# Altium schematic sheet Power Management.SchDoc
size 381 x 241 mm; SheetNumber: 3; SheetTotal: 4
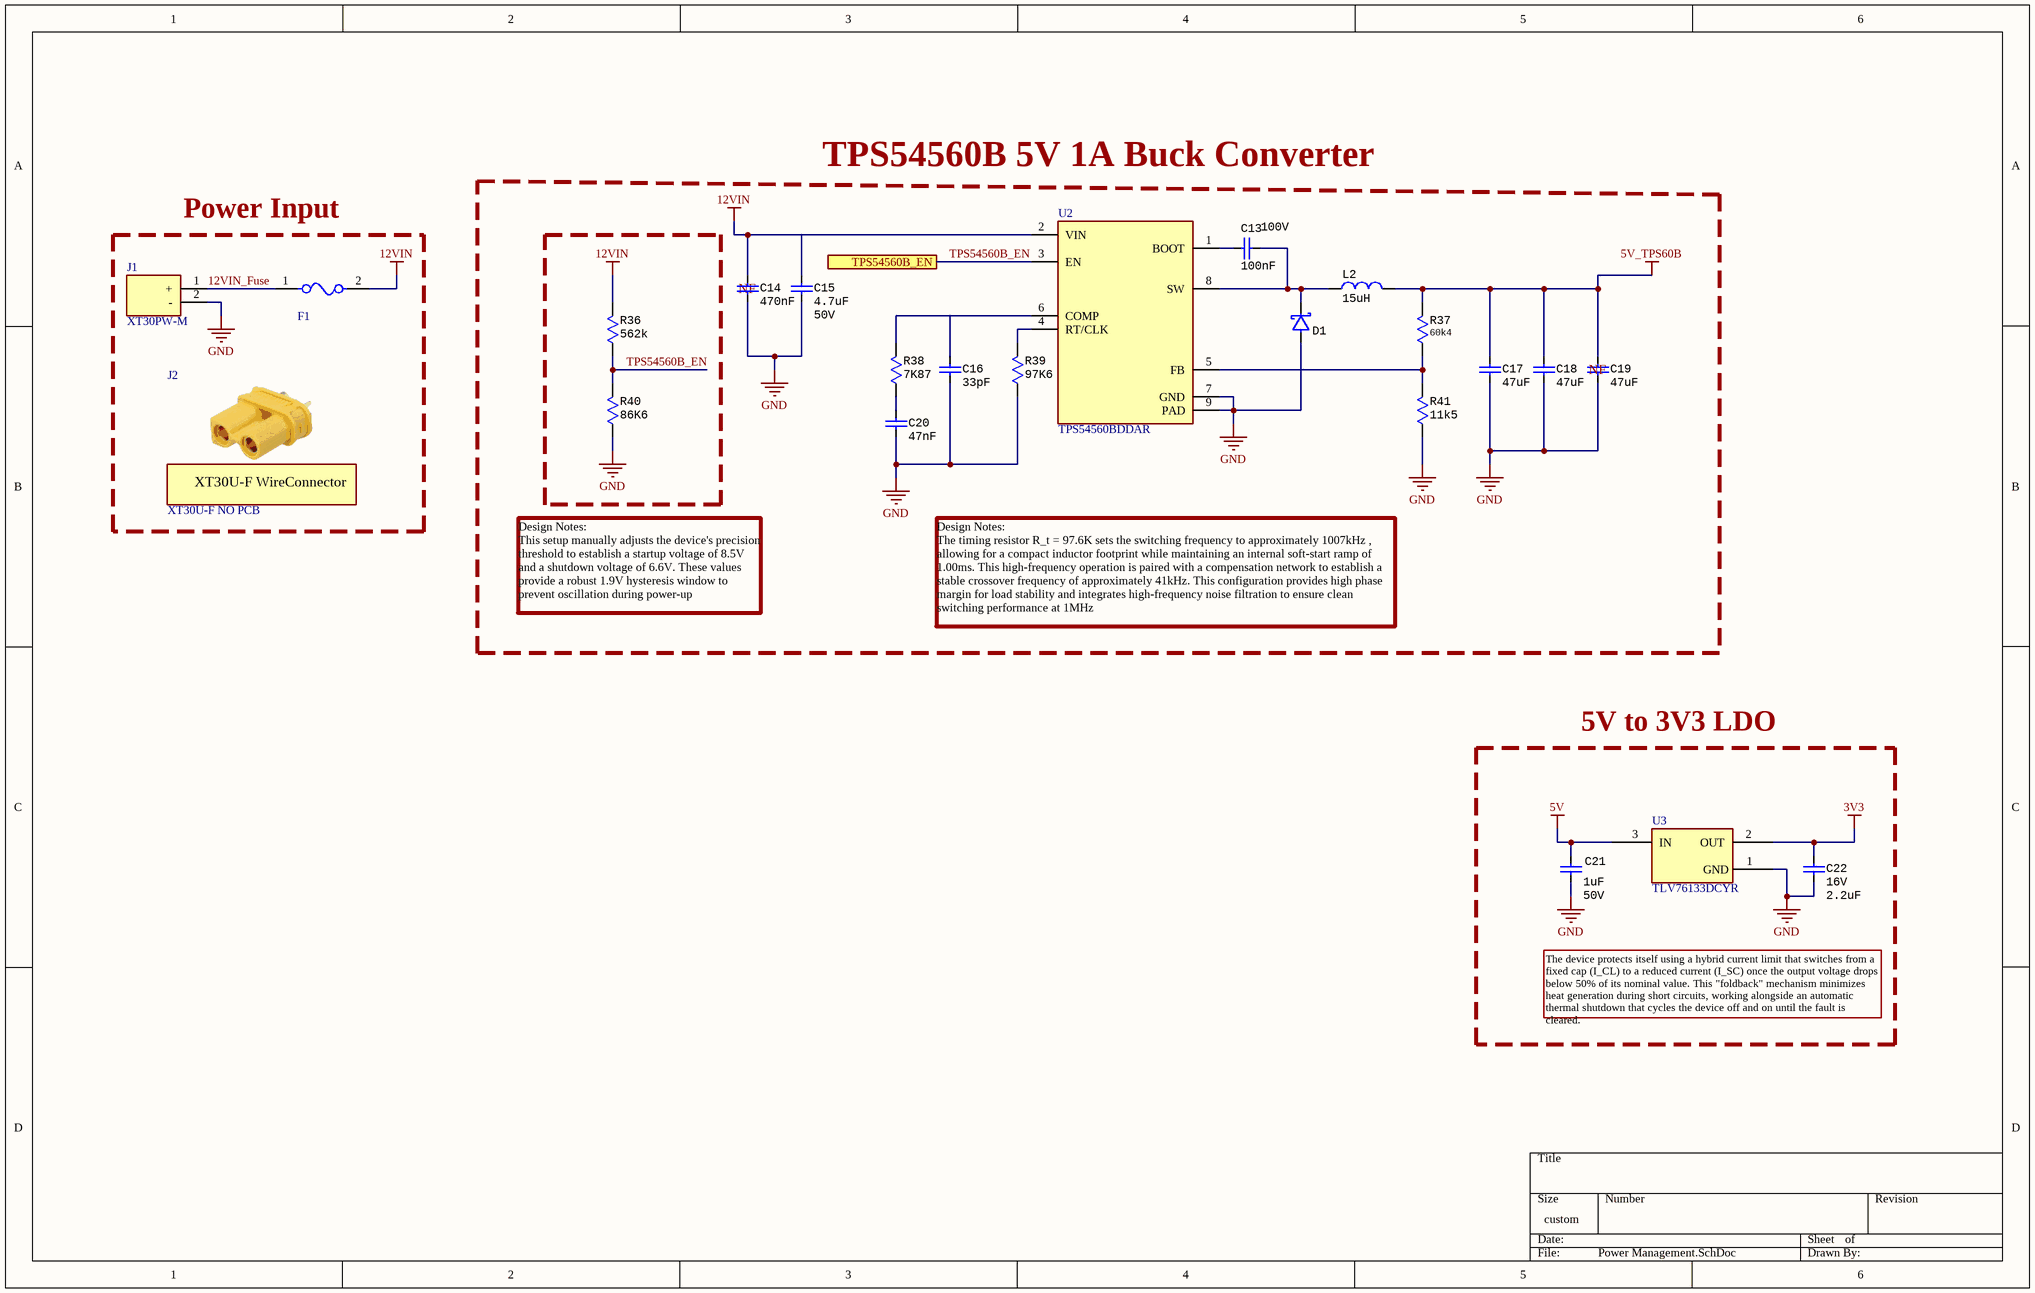
[diagram p0: Power Management.SchDoc]

## Parts
C13  value 100nF  Voltage: 100V  [CAP Ceramic SMD 0603]
C14  470nF  [CAP Ceramic SMD 0603]
C15  value 4.7uF  Voltage: 50V  [CAP Ceramic SMD 1206]
C16  33pF  [CAP Ceramic SMD 0402]
C17  47uF  [CAP Ceramic SMD 1210]
C18  47uF  [CAP Ceramic SMD 1210]
C19  47uF  [CAP Ceramic SMD 1210]
C20  47nF  [CAP Ceramic SMD 0402]
C21  value 1uF  Voltage: 50V  [CAP Ceramic SMD 0603]
C22  Voltage: 16V  [CAP Ceramic SMD 0603]  (hidden comment: 2.2uF)
D1  B360A-13-F  [DO-214AB]  (value not drawn)
F1  0452.500MRL  [Fuse SMD 2410 MFG]  (value not drawn)
J1  XT30PW-M  [XT30PW-M]
J2  XT30U-F NO PCB  (mechanical)
L2  15uH  [IND SMD VLS6045EX]
R36  562k  [RES SMD 0603]
R37  60k4  [RES SMD 0603]
R38  7K87  [CAP Ceramic SMD 0402]
R39  97K6  [RES SMD 0603]
R40  86K6  [RES SMD 0603]
R41  11k5  [RES SMD 0603]
U2  TPS54560BDDAR  [LMR14050]
U3  TLV76133DCYR  [SOT-223]

## Ports
TPS54560B_EN

## Nets
3V3: C22.1 U3.2(OUT)
5V: C21.1 U3.3(IN)
5V_TPS60B: C17.1 C18.1 C19.1 L2.1 R37.2
12VIN: C14.1 C15.1 F1.2 R36.2 U2.2(VIN)
GND: C14.2 C15.2 C16.2 C17.2 C18.2 C19.2 C20.2 C21.2 C22.2 D1.1 J1.2(-) R39.1 R40.1 R41.1 U2.7(GND) U2.9(PAD) U3.1(GND)
12VIN_Fuse: F1.1 J1.1(+)
TPS54560B_EN: R36.1 R40.2 U2.3(EN) ; port TPS54560B_EN
NetC13_1: C13.1 U2.1(BOOT)
NetC13_2: C13.2 D1.2 L2.2 U2.8(SW)
NetC16_1: C16.1 R38.2 U2.6(COMP)
NetC20_1: C20.1 R38.1
NetR37_1: R37.1 R41.2 U2.5(FB)
NetR39_2: R39.2 U2.4(RT/CLK)

## Notes on the sheet
- TPS54560B 5V 1A Buck Converter
- Power Input
- (near C14) NF
- (near C19) NF
- Design Notes:
  This setup manually adjusts the device's precision threshold to establish a startup voltage of 8.5V and a shutdown voltage of 6.6V. These values provide a robust 1.9V hysteresis window to prevent oscillation during power-up
- Design Notes:
  The timing resistor R_t = 97.6K sets the switching frequency to approximately 1007kHz , allowing for a compact inductor footprint while maintaining an internal soft-start ramp of 1.00ms. This high-frequency operation is paired with a compensation network to establish a stable crossover frequency of approximately 41kHz. This configuration provides high phase margin for load stability and integrates high-frequency noise filtration to ensure clean switching performance at 1MHz
- 5V to 3V3 LDO
- The device protects itself using a hybrid current limit that switches from a fixed cap (I_CL) to a reduced current (I_SC) once the output voltage drops below 50% of its nominal value. This "foldback" mechanism minimizes heat generation during short circuits, working alongside an automatic thermal shutdown that cycles the device off and on until the fault is cleared.
- (in symbol XT30U-F NO PCB) XT30U-F WireConnector

## Library data of the parts
C13 = CAP 0603 100nF 100V X7R 10%: 100V 100nF X7R ±10% 0603 Multilayer Ceramic Capacitors MLCC - SMD/SMT ROHS; Manufacturer: Yageo; Manufacturer Part Number: CC0603KRX7R0BB104; Supplier: LCSC; Supplier Part Number: C113803; Temperature Characteristics Code: X7R
C14 = CAP 0603 470nF 25V: 470nF ±10% 25V Ceramic Capacitor X7R 0603; Manufacturer: Samsung Electro-Mechanics; Manufacturer Part Number: CL10B474KA8NNNC; Dissipation Factor: 2.5%; Insulation Resistance: 10GR; Voltage: 50V; Depth: 0.8mm; Capacitance: 470nF; Case Code (Imperial): 0603; Case Code (Metric): 1608; Case/Package: 0603; Category: Ceramic Capacitors; Dielectric: X7R; Dielectric Material: Ceramic; Halogen Free: Halogen Free; Height: 0.8mm; Lead Free: Lead Free; Length: 1.6mm; Material: Ceramic; Max Operating Temperature: 125°C; Min Operating Temperature: -55°C; Mount: Surface Mount; Number of Pins: 2; Package Quantity: 1; Packaging: Tape and Reel; Radiation Hardening: No; Resistor Type: Ceramic; RoHS Compliant: Yes; Series: CC; Termination: SMD/SMT; Thickness: 0.035inch; Tolerance: 10%; Voltage Rating: 50V; Voltage Rating (DC): 50V; Width: 0.031inch; Supplier: LCSC; Supplier Part Number: C1623
C15 = CAP 1206 4.7uF 50V X7R: CAP CER 4.7uF 50V X7R 1206; Manufacturer: Samsung Electro-Mechanics; Manufacturer Part Number: CL31B475KBHNNNE; Supplier: LCSC; Supplier Part Number: C51205
C16 = CAP 0402 33pF 50V C0G: CAP CER 33pF 50V C0G 0402; Manufacturer: Samsung Electro-Mechanics; Manufacturer Part Number: GRM155R71E473KA88D; Capacitance: 33pF; Supplier: LCSC; Supplier Part Number: C70465; Voltage: 50V
C17-C19 = CAP 1210 47uF 10V X7R: 47uF ±10% 10V Ceramic Capacitor X7R 1210; Manufacturer: muRata; Manufacturer Part Number: GRM32ER71A476KE15L; Supplier: LCSC; Supplier Part Number: C84494; Case/Package: 1210; Value: 47uF; Temperature Characteristics Code: X7R; Voltage Rating: 10V
C20 = CAP 0402 47nF 25V: CAP CER 47nF 25V X7R 0402; Manufacturer: muRata; Manufacturer Part Number: GRM155R71E473KA88D; Dielectric Material: Ceramic; Dissipation Factor: 2.5%; Insulation Resistance: 10GR; Tolerance: 10%; Depth: 0.8mm; Capacitance: 47nF; Case Code (Imperial): 0603; Case Code (Metric): 1608; Case/Package: 0402; Category: Ceramic Capacitors; Dielectric: X7R; Halogen Free: Halogen Free; Height: 0.8mm; Lead Free: Lead Free; Length: 1.6mm; Material: Ceramic; Max Operating Temperature: 125°C; Min Operating Temperature: -55°C; Mount: Surface Mount; Number of Pins: 2; Package Quantity: 1; Packaging: Tape and Reel; Radiation Hardening: No; Resistor Type: Ceramic; RoHS Compliant: Yes; Series: CC; Termination: SMD/SMT; Thickness: 0.035inch; Voltage: 25V; Voltage Rating: 25V; Voltage Rating (DC): 25V; Width: 0.031inch; Supplier: LCSC; Supplier Part Number: C77017
C21 = CAP 0603 1uF 50V X7R 10%: 50V 1uF X7R ±10% 0603 Multilayer Ceramic Capacitors MLCC - SMD/SMT ROHS; Manufacturer: YAGEO; Manufacturer Part Number: CC0603KRX7R9BB105; Supplier: LCSC; Temperature Characteristics Code: X7R; Supplier Part Number: C559769
C22 = CAP 0603 2.2uF 16V: 16V 2.2uF X5R ±10% 0603 Multilayer Ceramic Capacitors MLCC - SMD/SMT ROHS; Manufacturer: YAGEO; Manufacturer Part Number: CC0603KRX5R7BB225; Supplier: LCSC; Supplier Part Number: C106853; Capacitance: 2.2uF
D1 = DIODES B560C-13-F: Voltage： 60V Current： 5A; Manufacturer: DIODES; Manufacturer Part Number: B560C-13-F; Supplier: LCSC; Supplier Part Number: C85100
F1 = Littelfuse 0452.500MRL: FUSE BRD MNT 500mA 125VAC/VDC 2410; Manufacturer: Littelfuse; Manufacturer Part Number: 0452.500MRL; Supplier: LCSC; Supplier Part Number: C151120
J1 = XT30PW-M: Power Connectors ROHS; Manufacturer: Changzhou Amass Elec; Manufacturer Part Number: XT30PW-M30.G.Y; Supplier: LCSC; Supplier Part Number: C431092
J2 = XT30U-F NO PCB: Power Connectors ROHS; Manufacturer: Changzhou Amass Elec; Manufacturer Part Number: XT30U-F; Supplier: LCSC; Supplier Part Number: C99102
L2 = IND 6X6mm 15uF 20%_1: FIXED IND 15uH 2.5A 75mΩ SMD,6x6mm; Manufacturer: TDK; Manufacturer Part Number: VLS6045EX-150M; Suppleir Part Number: C404502; Supplier: LCSC
R36 = RES 0603 562k 1%: 100mW 562kΩ 75V Thick Film Resistor ±100ppm/℃ ±1% 0603 Chip Resistor - Surface Mount RoHS; Manufacturer: YAGEO; Manufacturer Part Number: RC0603FR-07562KL; Supplier: LCSC; Supplier Part Number: C185319; Value: 562k
R37 = RES 0603 60k4 1%: RES 60.4kΩ ±1% 100mW 0603; Manufacturer: Yageo; Manufacturer Part Number: RC0603FR-0760K4L; Voltage Rating: 50V; Temperature Coefficient: 100ppm/°C; Resistance: 60k4; Supplier: LCSC; Supplier Part Number: C165742; RoHS: Yes; Category: Chip SMD Resistors; Stock: 51500; Pricing: 100=0.0013 (USD); Case/Package: 0603; Number of Pins: 2; Case Code (Metric): 1608; Case Code (Imperial): 0603; Size Code: 0603; Min Operating Temperature: -55°C; Max Operating Temperature: 155°C; Package Quantity: 1; Power Rating: 100mW; Tolerance: 1%; Packaging: Tape and Reel; Voltage Rating (DC): 50V; Resistor Type: Thick Film; Number of Terminations: 2; Termination: SMD/SMT; Max Power Dissipation: 100mW; Features: Moisture Resistant; Series: RC; Resistance Tolerance: 1%; Technology: THICK FILM; Construction: Rectangular; Length: 1.6mm; Width: 0.8mm; Height: 0.45mm; Depth: 0.8mm; Military Standard: Not; Lead Free: Lead Free; RoHS Compliant: Yes
R38 = RES 0402 7k87 1%: RES 7.87kΩ ±1% 62.5mW 0402; Manufacturer: YAGEO; Manufacturer Part Number: RC0402FR-077K87L; Max Power Dissipation: 100mW; Supplier: LCSC; Resistance: 7K87; Tolerance: 1%; Supplier Part Number: C185394; Stock 2: 800; Pricing 2: 50=0.009200, 500=0.007300, 1500=0.006200, 5000=0.005500, 25000=0.005000, 50000=0.004700 (AUD); Contact Plating: Tin; Number of Terminations: 2; Series: ERJ; Package Quantity: 1; Features: Automotive AEC-Q200; Construction: Rectangular; Resistance Tolerance: 1%; Technology: THICK FILM; Width: 0.031inch; Radiation Hardening: No; Lead Free: Lead Free; Value: 7K87
R39 = RES 0603 97k6 1%: 97.6kΩ 100mW 75V Thick Film Resistor ±100ppm/℃ ±1% 0603 Chip Resistor - Surface Mount RoHS; Manufacturer: YAGEO; Manufacturer Part Number: AC0603FR-0797K6L; Supplier: LCSC; Supplier Part Number: C228109; Value: 97K6
R40 = RES 0603 86k6 1%: RES 86.6kΩ ±1% 100mW 0603; Manufacturer: YAGEO; Manufacturer Part Number: RC0603FR-0786K6L; Supplier Part Number: C141683; Supplier: LCSC; Resistance: 86K6
R41 = RES 0603 11k5 1%: RES 11.5kΩ ±1% 100mW 0603; Manufacturer: YAGEO; Manufacturer Part Number: RC0603FR-0711K5L; Supplier Part Number: C137802; Supplier: LCSC; Resistance: 11k5
U2 = TPS54560BDDAR: 4.5V to 60V input, 5A step-down DC/DC converter; Manufacturer: TI; Manufacturer Part Number: TPS54560BDDAR; Supplier: LCSC; Supplier Part Number: C1850354
U3 = TLV76133DCYR: 3V3 Linear Voltage Regulator IC Positive Fixed 1 Output 1A SOT-223; Manufacturer: TI; Manufacturer Part Number: TLV76133DCYR; Supplier: LCSC; Supplier Part Number: C7527500